# EAGLE schematic FredT232H.Board (EAGLE 9.6.2)
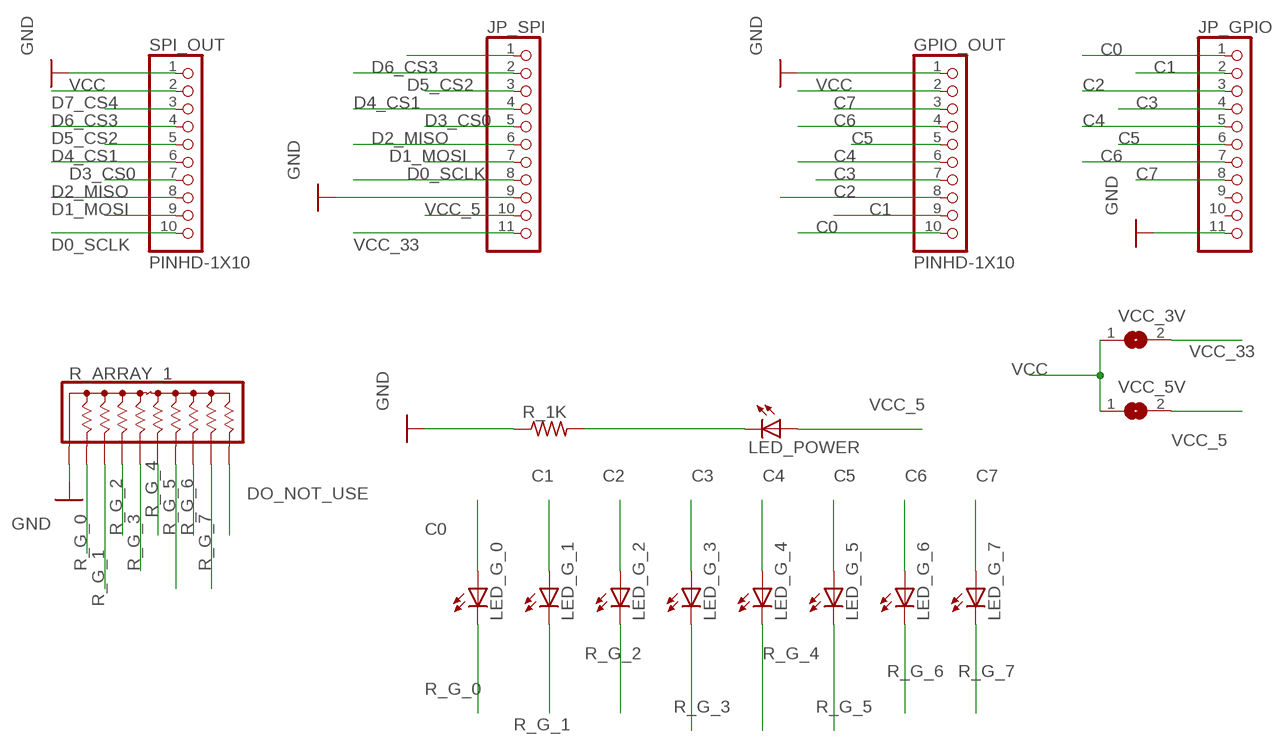
[diagram p0: schematic, sheet 1]

## Parts
GPIO_OUT  PINHD-1X10  [1X10-BIG]
JP_GPIO  PINHD-1X11  [1X11]
JP_SPI  PINHD-1X11  [1X11]
LED_G_0  LEDSMT1206  [1206]
LED_G_1  LEDSMT1206  [1206]
LED_G_2  LEDSMT1206  [1206]
LED_G_3  LEDSMT1206  [1206]
LED_G_4  LEDSMT1206  [1206]
LED_G_5  LEDSMT1206  [1206]
LED_G_6  LEDSMT1206  [1206]
LED_G_7  LEDSMT1206  [1206]
LED_POWER  LEDSMT1206  [1206]
R_1K  R-US_R1206  [R1206]
R_ARRAY_1  4610X  [SIP10]
SPI_OUT  PINHD-1X10  [1X10-BIG]
VCC_3V  SOLDERJUMPERREFLOW  [SOLDERJUMPER_REFLOW]
VCC_5V  SOLDERJUMPERREFLOW  [SOLDERJUMPER_REFLOW]

## Nets
C0: GPIO_OUT.10 JP_GPIO.1 LED_G_0.A
C1: GPIO_OUT.9 JP_GPIO.2 LED_G_1.A
C2: GPIO_OUT.8 JP_GPIO.3 LED_G_2.A
C3: GPIO_OUT.7 JP_GPIO.4 LED_G_3.A
C4: GPIO_OUT.6 JP_GPIO.5 LED_G_4.A
C5: GPIO_OUT.5 JP_GPIO.6 LED_G_5.A
C6: GPIO_OUT.4 JP_GPIO.7 LED_G_6.A
C7: GPIO_OUT.3 JP_GPIO.8 LED_G_7.A
D0_SCLK: JP_SPI.8 SPI_OUT.10
D1_MOSI: JP_SPI.7 SPI_OUT.9
D2_MISO: JP_SPI.6 SPI_OUT.8
D3_CS0: JP_SPI.5 SPI_OUT.7
D4_CS1: JP_SPI.4 SPI_OUT.6
D5_CS2: JP_SPI.3 SPI_OUT.5
D6_CS3: JP_SPI.2 SPI_OUT.4
D7_CS4: JP_SPI.1 SPI_OUT.3
DO_NOT_USE: R_ARRAY_1.10
GND: GPIO_OUT.1 JP_GPIO.11 JP_SPI.9 R_1K.1 R_ARRAY_1.1 SPI_OUT.1
N$1: LED_POWER.C R_1K.2
R_G_0: LED_G_0.C R_ARRAY_1.2
R_G_1: LED_G_1.C R_ARRAY_1.3
R_G_2: LED_G_2.C R_ARRAY_1.4
R_G_3: LED_G_3.C R_ARRAY_1.5
R_G_4: LED_G_4.C R_ARRAY_1.6
R_G_5: LED_G_5.C R_ARRAY_1.7
R_G_6: LED_G_6.C R_ARRAY_1.8
R_G_7: LED_G_7.C R_ARRAY_1.9
VCC: GPIO_OUT.2 SPI_OUT.2 VCC_3V.1 VCC_5V.1
VCC_5: JP_SPI.10 LED_POWER.A VCC_5V.2
VCC_33: JP_SPI.11 VCC_3V.2
Unconnected: JP_GPIO.9 JP_GPIO.10

## Library data of the parts
GPIO_OUT SPI_OUT = adafruit:PINHD-1X10: Pin header 1x10 0.1" spacing With round pins
JP_GPIO JP_SPI = pinhead:PINHD-1X11: PIN HEADER
LED_G_0 LED_G_1-LED_G_7 LED_POWER = adafruit:LED: LED OSRAM: - CHIPLED LG R971, LG N971, LY N971, LG Q971, LY Q971, LO R971, LY R971 LH N974, LH R974 LS Q976, LO Q976, LY Q976 LO Q996 - Hyper CHIPLED LW Q18S LB Q993, LB Q99A, LB R99A - SideLED LS A670, LO A670, LY A670, LG A670, LP A670 LB A673, LV A673, LT A673, LW A673 LH A674 LY A675 LS A676, LA A676, LO A676, LY A676, LW A676 LS A679, LY A679, LG A679 - Hyper Micro SIDELED® LS Y876, LA Y876, LO Y876, LY Y876 LT Y87S - SmartLED LW L88C, LW L88S LB L89C, LB L89S, LG L890 LS L89K, LO L89K, LY L89K LS L896, LA L896, LO L896, LY L896 - TOPLED LS T670, LO T670, LY T670, LG T670, LP T670 LSG T670, LSP T670, LSY T670, LOP T670, LYG T670 LG T671, LOG T671, LSG T671 LB T673, LV T673, LT T673, LW T673 LH T674 LS T676, LA T676, LO T676, LY T676, LB T676, LH T676, LSB T676, LW T676 LB T67C, LV T67C, LT T67C, LS T67K, LO T67K, LY T67K, LW E67C LS E67B, LA E67B, LO E67B, LY E67B, LB E67C, LV E67C, LT E67C LW T67C LS T679, LY T679, LG T679 LS T770, LO T770, LY T770, LG T770, LP T770 LB T773, LV T773, LT T773, LW T773 LH T774 LS E675, LA E675, LY E675, LS T675 LS T776, LA T776, LO T776, LY T776, LB T776 LHGB T686 LT T68C, LB T68C - Hyper Mini TOPLED® LB M676 - Mini TOPLED Santana® LG M470 LS M47K, LO M47K, LY M47K Source: http://www.osram.convergy.de/
R_1K = adafruit:R-US_: RESISTOR, American symbol
R_ARRAY_1 = resistor-sip:4610X: Bourns 4600X Series - Thick Film Conformal SIPs 4610X-101 Resistor Network Configuration: 101 (Bussed Resistors) Resistance range: 10 ohms to 10 Megaohms Maximum Operating Voltage: 100V Source: http://www.bourns.com/ProductLine.aspx?name=standard_thick_film_networks PDF: http://www.bourns.com/data/global/pdfs/4600X.pdf
VCC_3V VCC_5V = microbuilder:SOLDERJUMPER: SMD Solder JUMPER Solder the two pads together to create a connection, or remove the solder to break it. REFLOW - Use this footprint for solder paste and reflow ovens. WAVE - Use this footprint for hand-soldering (larger pads). CLOSED - Has a trace between the two pads to ensure it is closed by default. The trace needs to be cut to disable the jumper, and can be closed again by creating a solder bridge between the two pads.